# EAGLE design Narrow AAA sensor v1_1 (EAGLE 7.3.0)
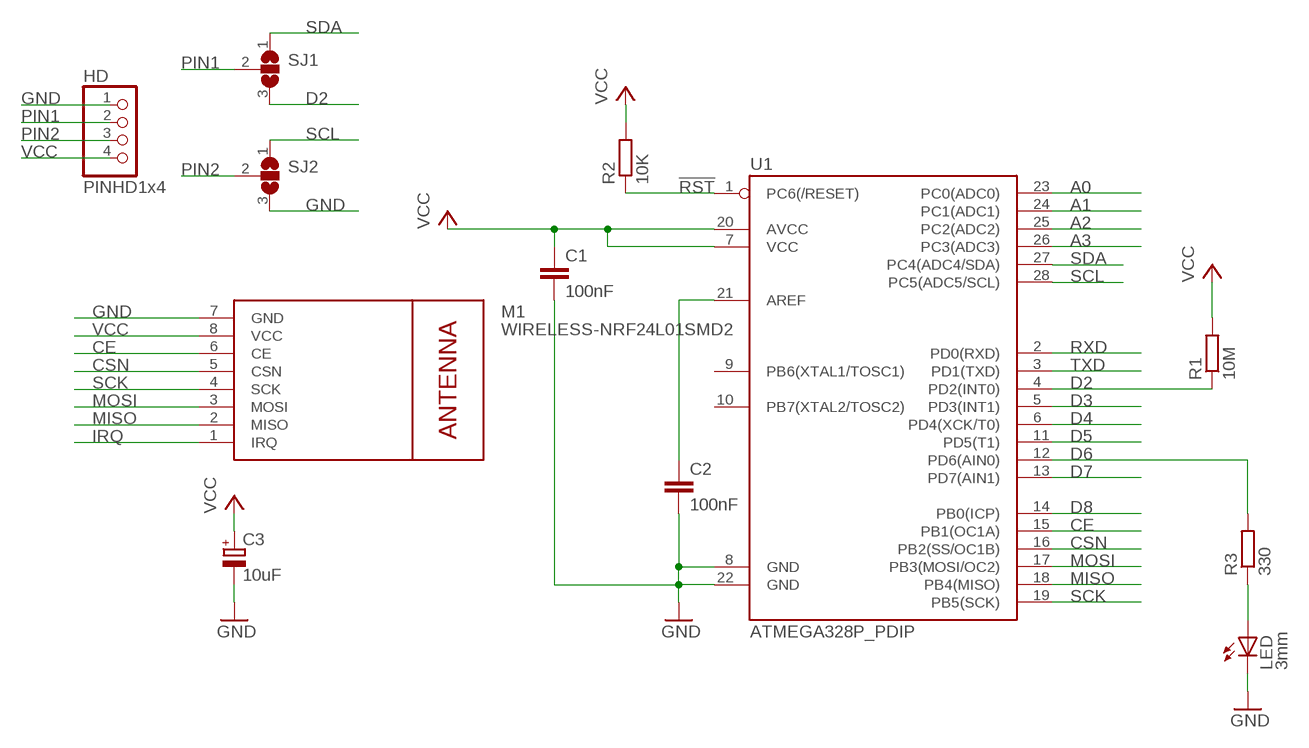
[diagram p0: schematic, sheet 1]

## Parts
C1  100nF  C-EU025-025X050  [C025-025X050]
C2  100nF  C-EU025-025X050  [C025-025X050]
C3  10uF  CPOL-EUE2.5-5  [E2,5-5]
HD  PINHD1x4  PINHD-1X4  [1X04]
LED  3mm  LED3MM  [LED3MM]
M1  WIRELESS-NRF24L01SMD2  [WIRELESS-NRF24L01-SMD-2]
R1  10M  R-EU_0204/7  [0204/7]
R2  10K  R-EU_0204/7  [0204/7]
R3  330  R-EU_0204/7  [0204/7]
SJ1  SJ2W  [SJ_2]
SJ2  SJ2W  [SJ_2]
U1  ATMEGA328P_PDIP  [DIL28-3]

## Nets
!RST: R2.1 U1.1(PC6(/RESET))
A0: U1.23(PC0(ADC0))
A1: U1.24(PC1(ADC1))
A2: U1.25(PC2(ADC2))
A3: U1.26(PC3(ADC3))
CE: M1.6(CE) U1.15(PB1(OC1A))
CSN: M1.5(CSN) U1.16(PB2(SS/OC1B))
D2: R1.1 SJ1.3 U1.4(PD2(INT0))
D3: U1.5(PD3(INT1))
D4: U1.6(PD4(XCK/T0))
D5: U1.11(PD5(T1))
D6: R3.2 U1.12(PD6(AIN0))
D7: U1.13(PD7(AIN1))
D8: U1.14(PB0(ICP))
GND [power]: C1.2 C2.2 C3.- HD.1 LED.K(C) M1.7(GND) SJ2.3 U1.8(GND) U1.22(GND)
IRQ: M1.1(IRQ)
MISO: M1.2(MISO) U1.18(PB4(MISO))
MOSI: M1.3(MOSI) U1.17(PB3(MOSI/OC2))
N$3: LED.A R3.1
N$8: C2.1 U1.21(AREF)
PIN1: HD.2 SJ1.2
PIN2 [power]: HD.3 SJ2.2
RXD: U1.2(PD0(RXD))
SCK: M1.4(SCK) U1.19(PB5(SCK))
SCL: SJ2.1 U1.28(PC5(ADC5/SCL))
SDA: SJ1.1 U1.27(PC4(ADC4/SDA))
TXD: U1.3(PD1(TXD))
VCC [power]: C1.1 C3.+ HD.4 M1.8(VCC) R1.2 R2.2 U1.7(VCC) U1.20(AVCC)
Unconnected: U1.9(PB6(XTAL1/TOSC1)) U1.10(PB7(XTAL2/TOSC2))

## Library data of the parts
C1 C2 = GertSanders:C-EU: CAPACITOR, European symbol
C3 = rcl:CPOL-EU: POLARIZED CAPACITOR, European symbol
HD = GertSanders:PINHD-1X4: PIN HEADER
LED = adafruit:LED: LED OSRAM: - CHIPLED LG R971, LG N971, LY N971, LG Q971, LY Q971, LO R971, LY R971 LH N974, LH R974 LS Q976, LO Q976, LY Q976 LO Q996 - Hyper CHIPLED LW Q18S LB Q993, LB Q99A, LB R99A - SideLED LS A670, LO A670, LY A670, LG A670, LP A670 LB A673, LV A673, LT A673, LW A673 LH A674 LY A675 LS A676, LA A676, LO A676, LY A676, LW A676 LS A679, LY A679, LG A679 - Hyper Micro SIDELED® LS Y876, LA Y876, LO Y876, LY Y876 LT Y87S - SmartLED LW L88C, LW L88S LB L89C, LB L89S, LG L890 LS L89K, LO L89K, LY L89K LS L896, LA L896, LO L896, LY L896 - TOPLED LS T670, LO T670, LY T670, LG T670, LP T670 LSG T670, LSP T670, LSY T670, LOP T670, LYG T670 LG T671, LOG T671, LSG T671 LB T673, LV T673, LT T673, LW T673 LH T674 LS T676, LA T676, LO T676, LY T676, LB T676, LH T676, LSB T676, LW T676 LB T67C, LV T67C, LT T67C, LS T67K, LO T67K, LY T67K, LW E67C LS E67B, LA E67B, LO E67B, LY E67B, LB E67C, LV E67C, LT E67C LW T67C LS T679, LY T679, LG T679 LS T770, LO T770, LY T770, LG T770, LP T770 LB T773, LV T773, LT T773, LW T773 LH T774 LS E675, LA E675, LY E675, LS T675 LS T776, LA T776, LO T776, LY T776, LB T776 LHGB T686 LT T68C, LB T68C - Hyper Mini TOPLED® LB M676 - Mini TOPLED Santana® LG M470 LS M47K, LO M47K, LY M47K Source: http://www.osram.convergy.de/
M1 = GertSanders:WIRELESS-NRF24L01: 2.4 GHz Wireless Module based on NRF24L01 chip
R1-R3 = rcl:R-EU_: RESISTOR, European symbol
SJ1 SJ2 = jumper:SJ2W: SMD solder JUMPER
U1 = GertSanders:ATMEGA328P_PDIP: uC used in the Arduino 32kb flash, 1k EEPROM, 2k SRAM This is the through-hole version of this chip.

## Net classes
1 power: width 0.356 mm, clearance 0.178 mm

## Board
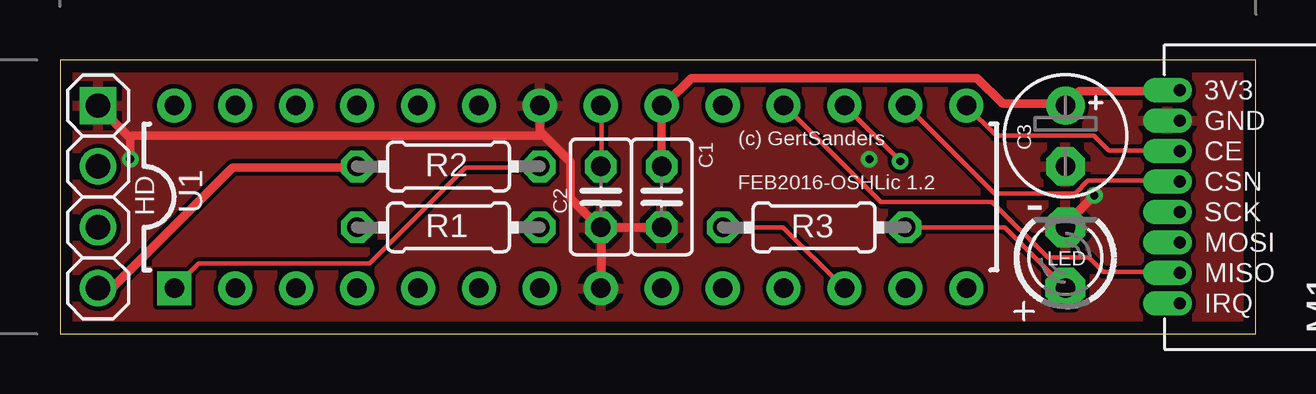
[diagram p1: board, top side]
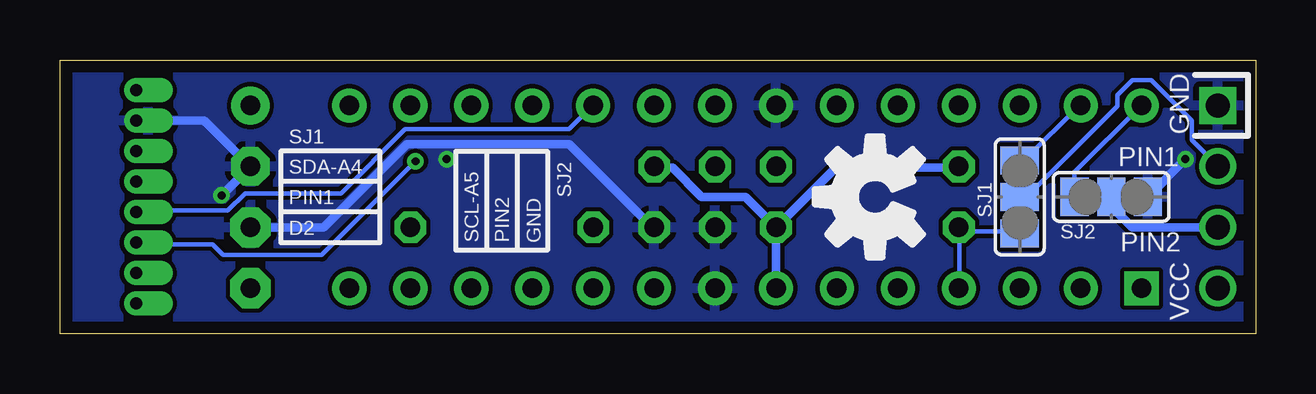
[diagram p2: board, bottom side, seen from below]

Size 49.85 x 11.43 mm. Coordinates in mm from the lower left corner, seen from the top.
Outline: 0,0 49.85,0 49.85,11.43 0,11.43 0,0
Copper layers (1*16): Top 0.035mm / dielectric 1.5011mm / Bottom 0.035mm
Design rules "Gert_Sanders *": minimum track width 7mil, minimum drill 13mil, track to track 7mil, track to pad 7mil, pad to pad 7mil, via to via 7mil, smd to smd 7mil, copper to edge 20mil, drill to drill 10mil, minimum pad ring 10mil, minimum via ring 7mil, stop-mask expansion 3mil, vias tented up to drill 14mil, thermal gap 10mil

### Footprints (pad centres in the part's own frame; a part is rotated, then mirrored left to right if it is on the bottom)
C025-025X050 = drill 0.813 octagon: 1 -1.27,0; 2 1.27,0
E2,5-5 = drill 0.813 pad 1.6: + -1.27,0 | drill 0.813 pad 1.6 octagon: - 1.27,0
1X04 = drill 1.016 square: 1 -3.81,0 | drill 1.016: 2 -1.27,0; 3 1.27,0; 4 3.81,0
LED3MM = drill 0.813 pad 1.676 octagon: A -1.27,0; K 1.27,0
WIRELESS-NRF24L01-SMD-2 = drill 0.5 pad 1.016 offset: 1 1.905,0; 2 1.905,1.27; 3 1.905,2.54; 4 1.905,3.81; 5 1.905,5.08; 6 1.905,6.35; 7 1.905,7.62; 8 1.905,8.89
0204/7 = drill 0.813 octagon: 1 -3.81,0; 2 3.81,0
SJ_2 = smd 1.168 x 1.6: 1 -1.524,0; 2 0,0; 3 1.524,0
DIL28-3 = drill 0.813 pad 1.422 square: 1 -16.51,-3.81 | drill 0.813 pad 1.422: 2 -13.97,-3.81; 3 -11.43,-3.81; 4 -8.89,-3.81; 5 -6.35,-3.81; 6 -3.81,-3.81; 7 -1.27,-3.81; 8 1.27,-3.81; 9 3.81,-3.81; 10 6.35,-3.81; 11 8.89,-3.81; 12 11.43,-3.81; 13 13.97,-3.81; 14 16.51,-3.81; 15 16.51,3.81; 16 13.97,3.81; 17 11.43,3.81; 18 8.89,3.81; 19 6.35,3.81; 20 3.81,3.81; 21 1.27,3.81; 22 -1.27,3.81; 23 -3.81,3.81; 24 -6.35,3.81; 25 -8.89,3.81; 26 -11.43,3.81; 27 -13.97,3.81; 28 -16.51,3.81

### Placement (x,y rotation side)
C1  25.08,5.71 270 top
C2  22.54,5.71 270 top
C3  41.91,8.26 270 top
HD  1.59,5.71 270 top
LED  41.91,3.17 90 top
M1  44.77,1.27 0 top
R1  16.19,4.45 0 top
R2  16.19,6.99 180 top
R3  31.43,4.45 180 top
SJ1  9.84,5.71 270 bottom
SJ2  6.03,5.71 0 bottom
U1  21.27,5.71 0 top
U$1  [OSHWLOGO_TOL_0.2]  15.88,5.71 90 bottom

### Tracks (layer width: path | path; a pad name or v marks a point on that pad's centre or on a via)
!RST
  Top 0.178: R2.1 20,6.93 16.9,6.93 12.9,2.93 5.78,2.93 4.8,1.96 U1.1
CE
  Top 0.178: M1.6 46.67,7.64 43.71,7.64 43.09,8.27 39.03,8.27 37.78,9.51 U1.15
CSN
  Top 0.178: M1.5 46.67,6.4 42.85,6.4 42.32,5.87 38.94,5.87 35.29,9.51 U1.16
D2
  Bottom 0.178: SJ1.3 9.87,4.27 12.18,4.27 12.36,4.45 R1.1 12.36,4.36 12.36,1.96 U1.4
D6
  Top 0.178: R3.2 30.14,4.45 32.63,1.96 U1.12
GND  (via drill 0.33)
  Top 0.356: v43.12,5.78 41.96,4.62 41.96,4.45 LED.K | 2.93,8.18 v2.93,7.29 | HD.1 2.93,8.18 | C1.2 C2.2 | U1.8 22.58,1.96 22.58,4.36 C2.2 | U1.22 20,8.45 20.09,8.36 | 20.09,8.36 21.29,7.16 21.29,5.65 22.4,4.53 C2.2 | 2.93,8.18 3.02,8.27 20,8.27 20.09,8.36
  Bottom 0.356: M1.7 43.83,8.89 41.96,7.02 C3.- v43.12,5.78 | v2.93,7.29 SJ2.3 | LED.K 38.85,4.45 35.38,7.91 28.63,7.91 25.16,4.45 C1.2
  other vias: 33.73,7.29
  pour Bottom: -0.32,11.75 50.16,11.75 50.16,-0.32 -0.32,-0.32
  pour Top: -0.32,11.75 50.16,11.75 50.16,-0.32 -0.32,-0.32
MISO
  Top 0.178: M1.2 46.67,2.58 43.48,2.58 42.88,3.19 41.17,3.19 38.85,5.51 34.23,5.51 30.23,9.51 U1.18
MOSI  (via drill 0.33)
  Top 0.178: U1.17 v35.03,7.2
  Bottom 0.178: v35.03,7.2 38.94,3.29 43.04,3.29 43.48,3.73 46.67,3.73 M1.3
N$3
  Top 0.178: R3.1 39.38,4.45 41.87,1.96 LED.A
N$8
  Top 0.178: C2.1 22.58,7.02 22.58,9.51 U1.21
PIN1
  Bottom 0.178: SJ1.2 9.78,5.78 9.51,5.78 5.78,9.51 5.78,9.96 5.16,10.58 4.36,10.58 2.67,8.89 2.67,8.09 1.6,7.02 HD.2
PIN2
  Bottom 0.356: HD.3 5.16,4.45 5.96,5.25 5.96,5.69 SJ2.2
SCK
  Bottom 0.178: M1.4 46.67,5.16 42.85,5.16 42.14,5.87 38.14,5.87 35.47,8.53 28.63,8.53 27.65,9.51 U1.19
SCL
  Bottom 0.178: SJ2.1 7.56,6.76 4.8,9.51 U1.28
SDA
  Bottom 0.178: SJ1.1 9.78,7.29 9.6,7.29 7.38,9.51 U1.27
VCC
  Top 0.356: M1.8 46.67,10.13 42.49,10.13 41.96,9.6 C3.+ 41.78,9.6 39.29,9.6 38.23,10.67 26.31,10.67 25.25,9.6 U1.20 25.07,9.51 25.07,7.02 C1.1 | HD.4 1.6,1.96 2.21,1.96 7.19,6.93 12.36,6.93 R2.2
  Bottom 0.356: R1.2 17.51,6.93 12.45,6.93 R2.2 | R1.2 U1.7 | R1.2 21.27,5.71 23.1,5.71 24.32,6.93 25.07,6.93 C1.1

### Text on the board
tPlace: (c) GertSanders / / FEB2016-OSHLic 1.2 | -
bPlace: GND | PIN1 | SJ1 | SDA-A4 | SJ2 | PIN1 | PIN2 | GND | PIN2 | SCL-A5 | D2 | VCC